# Altium schematic sheet 4-Fuses.SchDoc
size A4
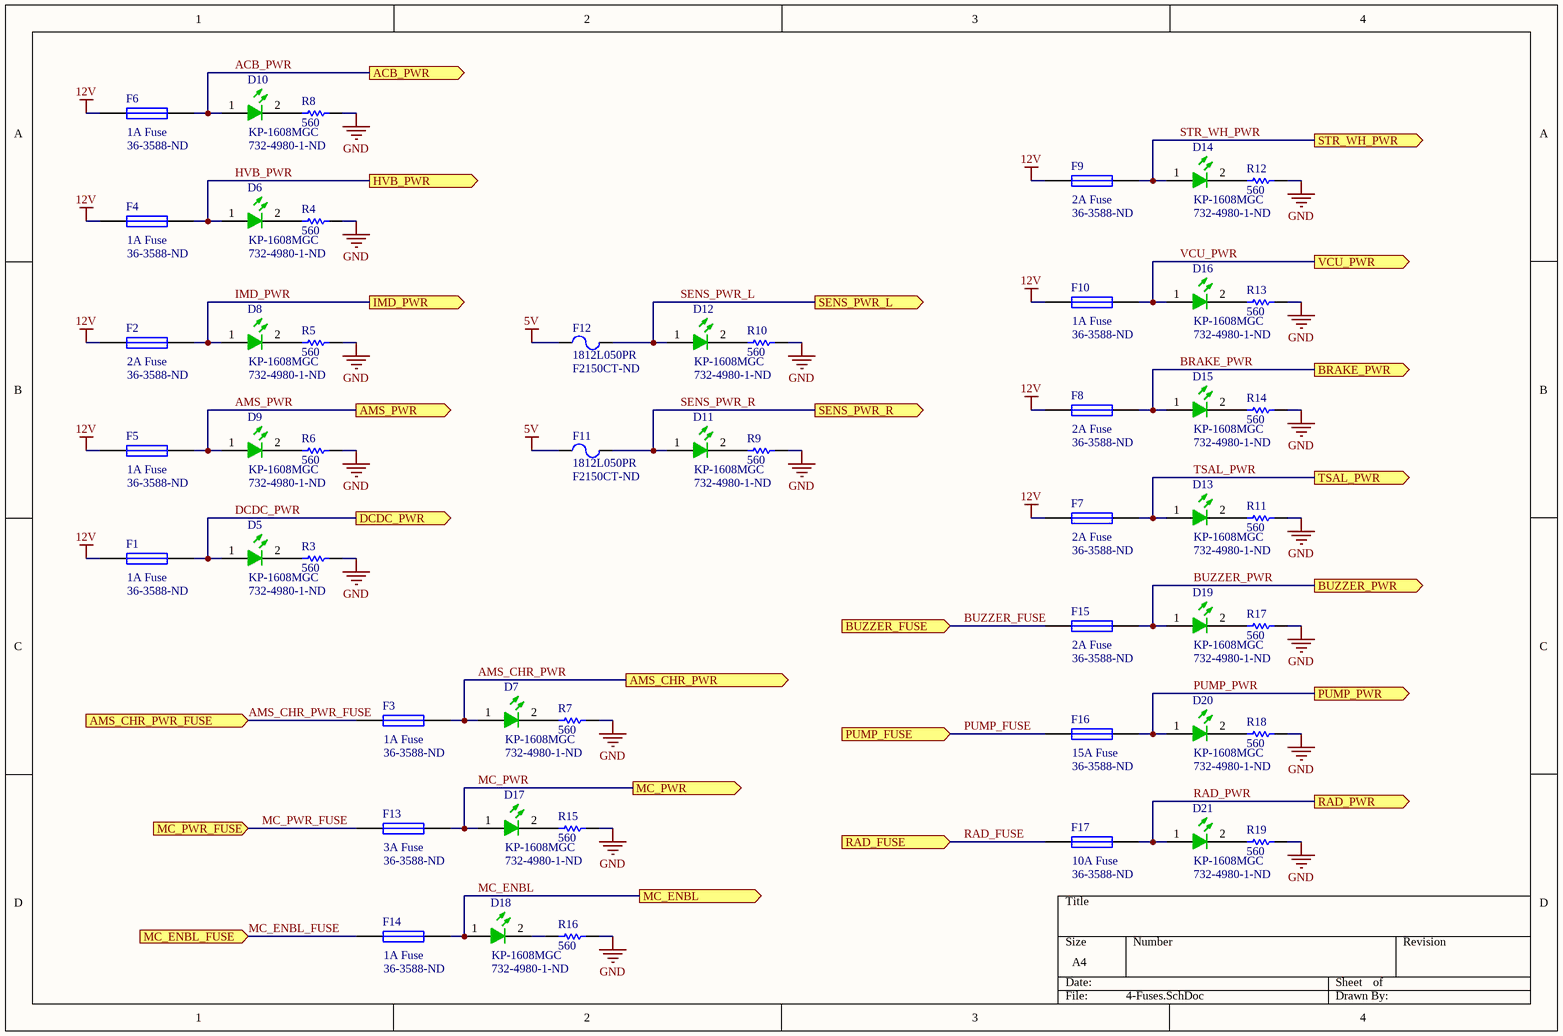
[diagram p0: 4-Fuses.SchDoc]

## Parts
D5  KP-1608MGC  Supplier Part Number 1: 732-4980-1-ND  [KING-0603LED_GREEN_V]
D6  KP-1608MGC  Supplier Part Number 1: 732-4980-1-ND  [KING-0603LED_GREEN_V]
D7  KP-1608MGC  Supplier Part Number 1: 732-4980-1-ND  [KING-0603LED_GREEN_V]
D8  KP-1608MGC  Supplier Part Number 1: 732-4980-1-ND  [KING-0603LED_GREEN_V]
D9  KP-1608MGC  Supplier Part Number 1: 732-4980-1-ND  [KING-0603LED_GREEN_V]
D10  KP-1608MGC  Supplier Part Number 1: 732-4980-1-ND  [KING-0603LED_GREEN_V]
D11  KP-1608MGC  Supplier Part Number 1: 732-4980-1-ND  [KING-0603LED_GREEN_V]
D12  KP-1608MGC  Supplier Part Number 1: 732-4980-1-ND  [KING-0603LED_GREEN_V]
D13  KP-1608MGC  Supplier Part Number 1: 732-4980-1-ND  [KING-0603LED_GREEN_V]
D14  KP-1608MGC  Supplier Part Number 1: 732-4980-1-ND  [KING-0603LED_GREEN_V]
D15  KP-1608MGC  Supplier Part Number 1: 732-4980-1-ND  [KING-0603LED_GREEN_V]
D16  KP-1608MGC  Supplier Part Number 1: 732-4980-1-ND  [KING-0603LED_GREEN_V]
D17  KP-1608MGC  Supplier Part Number 1: 732-4980-1-ND  [KING-0603LED_GREEN_V]
D18  KP-1608MGC  Supplier Part Number 1: 732-4980-1-ND  [KING-0603LED_GREEN_V]
D19  KP-1608MGC  Supplier Part Number 1: 732-4980-1-ND  [KING-0603LED_GREEN_V]
D20  KP-1608MGC  Supplier Part Number 1: 732-4980-1-ND  [KING-0603LED_GREEN_V]
D21  KP-1608MGC  Supplier Part Number 1: 732-4980-1-ND  [KING-0603LED_GREEN_V]
F1  1A Fuse  Supplier Part Number 1: 36-3588-ND  [FUSE 3588 Holder]
F2  2A Fuse  Supplier Part Number 1: 36-3588-ND  [FUSE 3588 Holder]
F3  1A Fuse  Supplier Part Number 1: 36-3588-ND  [FUSE 3588 Holder]
F4  1A Fuse  Supplier Part Number 1: 36-3588-ND  [FUSE 3588 Holder]
F5  1A Fuse  Supplier Part Number 1: 36-3588-ND  [FUSE 3588 Holder]
F6  1A Fuse  Supplier Part Number 1: 36-3588-ND  [FUSE 3588 Holder]
F7  2A Fuse  Supplier Part Number 1: 36-3588-ND  [FUSE 3588 Holder]
F8  2A Fuse  Supplier Part Number 1: 36-3588-ND  [FUSE 3588 Holder]
F9  2A Fuse  Supplier Part Number 1: 36-3588-ND  [FUSE 3588 Holder]
F10  1A Fuse  Supplier Part Number 1: 36-3588-ND  [FUSE 3588 Holder]
F11  1812L050PR  Supplier Part Number 1: F2150CT-ND  [LFUS-1812L050_V]
F12  1812L050PR  Supplier Part Number 1: F2150CT-ND  [LFUS-1812L050_V]
F13  3A Fuse  Supplier Part Number 1: 36-3588-ND  [FUSE 3588 Holder]
F14  1A Fuse  Supplier Part Number 1: 36-3588-ND  [FUSE 3588 Holder]
F15  2A Fuse  Supplier Part Number 1: 36-3588-ND  [FUSE 3588 Holder]
F16  15A Fuse  Supplier Part Number 1: 36-3588-ND  [FUSE 3588 Holder]
F17  10A Fuse  Supplier Part Number 1: 36-3588-ND  [FUSE 3588 Holder]
R3  560  [RESC0603(1608)_L]
R4  560  [RESC0603(1608)_L]
R5  560  [RESC0603(1608)_L]
R6  560  [RESC0603(1608)_L]
R7  560  [RESC0603(1608)_L]
R8  560  [RESC0603(1608)_L]
R9  560  [RESC0603(1608)_L]
R10  560  [RESC0603(1608)_L]
R11  560  [RESC0603(1608)_L]
R12  560  [RESC0603(1608)_L]
R13  560  [RESC0603(1608)_L]
R14  560  [RESC0603(1608)_L]
R15  560  [RESC0603(1608)_L]
R16  560  [RESC0603(1608)_L]
R17  560  [RESC0603(1608)_L]
R18  560  [RESC0603(1608)_L]
R19  560  [RESC0603(1608)_L]

## Ports
ACB_PWR (out), AMS_CHR_PWR (out), AMS_CHR_PWR_FUSE (in), AMS_PWR (out), BRAKE_PWR (out), BUZZER_FUSE (in), BUZZER_PWR (out), DCDC_PWR (out), HVB_PWR (out), IMD_PWR (out), MC_ENBL (out), MC_ENBL_FUSE (in), MC_PWR (out), MC_PWR_FUSE (in), PUMP_FUSE (in), PUMP_PWR (out), RAD_FUSE (in), RAD_PWR (out), SENS_PWR_L (out), SENS_PWR_R (out), STR_WH_PWR (out), TSAL_PWR (out), VCU_PWR (out)

## Nets
5V: F11.1 F12.1
12V: F1.1 F2.1 F4.1 F5.1 F6.1 F7.1 F8.1 F9.1 F10.1
GND: R3.2 R4.2 R5.2 R6.2 R7.2 R8.2 R9.2 R10.2 R11.2 R12.2 R13.2 R14.2 R15.2 R16.2 R17.2 R18.2 R19.2
ACB_PWR: D10.1(A) F6.2 ; port ACB_PWR
AMS_CHR_PWR: D7.1(A) F3.2 ; port AMS_CHR_PWR
AMS_CHR_PWR_FUSE: F3.1 ; port AMS_CHR_PWR_FUSE
AMS_PWR: D9.1(A) F5.2 ; port AMS_PWR
BRAKE_PWR: D15.1(A) F8.2 ; port BRAKE_PWR
BUZZER_FUSE: F15.1 ; port BUZZER_FUSE
BUZZER_PWR: D19.1(A) F15.2 ; port BUZZER_PWR
DCDC_PWR: D5.1(A) F1.2 ; port DCDC_PWR
HVB_PWR: D6.1(A) F4.2 ; port HVB_PWR
IMD_PWR: D8.1(A) F2.2 ; port IMD_PWR
MC_ENBL: D18.1(A) F14.2 ; port MC_ENBL
MC_ENBL_FUSE: F14.1 ; port MC_ENBL_FUSE
MC_PWR: D17.1(A) F13.2 ; port MC_PWR
MC_PWR_FUSE: F13.1 ; port MC_PWR_FUSE
PUMP_FUSE: F16.1 ; port PUMP_FUSE
PUMP_PWR: D20.1(A) F16.2 ; port PUMP_PWR
RAD_FUSE: F17.1 ; port RAD_FUSE
RAD_PWR: D21.1(A) F17.2 ; port RAD_PWR
SENS_PWR_L: D12.1(A) F12.2 ; port SENS_PWR_L
SENS_PWR_R: D11.1(A) F11.2 ; port SENS_PWR_R
STR_WH_PWR: D14.1(A) F9.2 ; port STR_WH_PWR
TSAL_PWR: D13.1(A) F7.2 ; port TSAL_PWR
VCU_PWR: D16.1(A) F10.2 ; port VCU_PWR
NetD5_2: D5.2(K) R3.1
NetD6_2: D6.2(K) R4.1
NetD7_2: D7.2(K) R7.1
NetD8_2: D8.2(K) R5.1
NetD9_2: D9.2(K) R6.1
NetD10_2: D10.2(K) R8.1
NetD11_2: D11.2(K) R9.1
NetD12_2: D12.2(K) R10.1
NetD13_2: D13.2(K) R11.1
NetD14_2: D14.2(K) R12.1
NetD15_2: D15.2(K) R14.1
NetD16_2: D16.2(K) R13.1
NetD17_2: D17.2(K) R15.1
NetD18_2: D18.2(K) R16.1
NetD19_2: D19.2(K) R17.1
NetD20_2: D20.2(K) R18.1
NetD21_2: D21.2(K) R19.1

## Library data of the parts
D5-D21 = CMP-0404-00001-1: LED, SMT, 0603(1608), 1.1mm thickness, Green; Manufacturer: Kingbright; Reverse Voltage: 5 V; Power Dissipation: 75 mW; Forward Current: 30 mA; Packing Type: 2000 pcs / reel; Mounting Technology: Surface Mount; Storage Temperature: -40 to +85 degC; ComponentLink1URL: http://www.kingbright.com/; PackageDescription: 2-Pin SMT LED, 1.6 x 0.8 mm Pitch; PartNumber: KP-1608MGC; PackageReference: 0603LED_GREEN; ComponentLink1Description: Manufacturer URL; Supplier 1: Digi-Key
F1-F10 F13-F17 = Fuse 1: Fuse; Published: 8-Jun-2000; LatestRevisionDate: 17-Jul-2002; LatestRevisionNote: Re-released for DXP Platform.; PackageReference: PIN-W2/E2.8; Publisher: Altium Limited; PackageDescription: Thru-Hole; 2 Leads; Supplier 1: Digi-Key
F11 F12 = CMP-1700-00002-1: POLY-FUSE(R) Resettable PTC, 0.5 A, 0.15 to 1 Ohm Resistance, -40 to 85 degC, 1812 (4532 Metric), RoHS, Tape and Reel; Voltage Rating: 50 V; Power Rating: 100 mW; Resistance: 150 kohm; Tolerance: 1%; Case\Package: 0603; ComponentLink2URL: http://www.littelfuse.com/~/media/electronics/datasheets/resettable_ptcs/littelfuse_ptc_1812l_datasheet.pdf.pdf; Pins: 2; Mount: Surface Mount; Width: 0.8 mm; Length: 1.6 mm; Package Quantity: 1; Max Operating Temperature: 155 degC; Case Code (Imperial): 0603; ComponentLink1Description: Manufacturer URL; PackageReference: 1812; ComponentLink1URL: http://www.littelfuse.com/; RoHSCompliant: true; Voltage Rating (DC): 50 V; Packaging: Tape and Reel; PackageDescription: 2-Pin Surface Mount Device, Body 4.55 x 3.24 mm; Min Operating Temperature: -55 degC; DatasheetVersion: Feb-16; REACH SVHC: No SVHC; Case Code (Metric): 1608; ComponentLink2Description: Datasheet; Height: 0.45 mm; Supplier 1: Digi-Key
R3-R19 = CMP-1591-00001-1: 0603 (1608 Metric) Chip Resistor; Case-Metric: 1608; Case-EIA: 0603; PackageReference: RESC0603(1608); Supplier 1: Digi-Key; Supplier Part Number 1: P560BZCT-ND